# Altium schematic sheet Sheet1.SchDoc
size A3
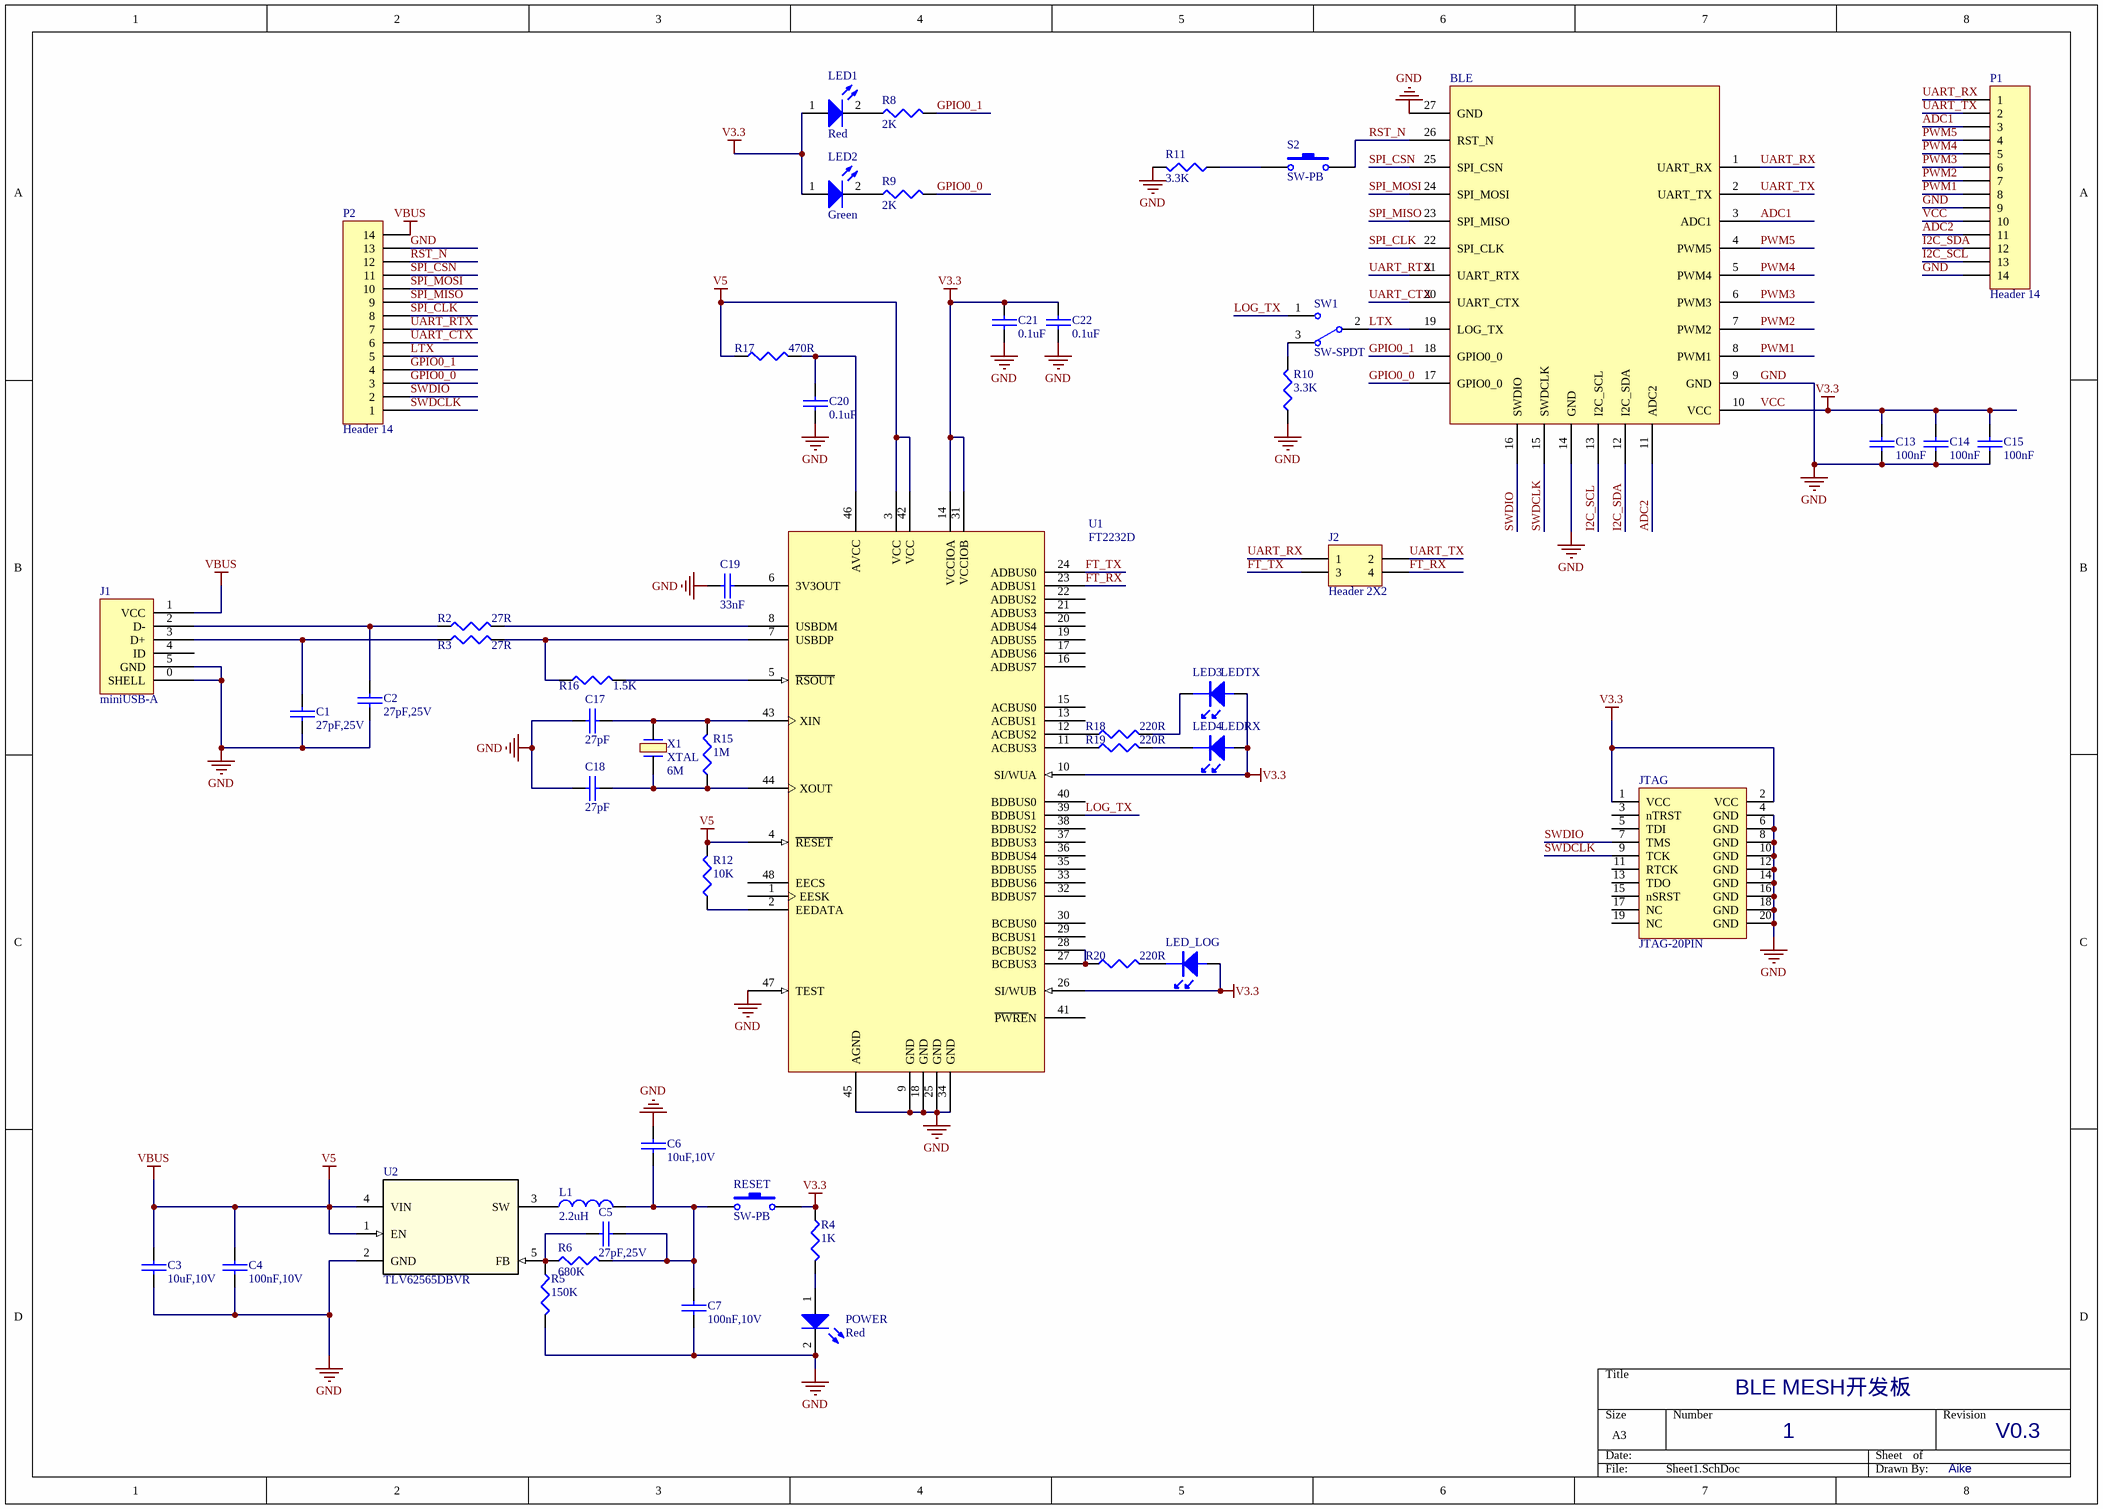
[diagram p0: Sheet1.SchDoc]

## Parts
BLE  BLE  [BLE]  (value not drawn)
C1  27pF,25V  [0603P]
C2  27pF,25V  [0603P]
C3  10uF,10V  [0603P]
C4  100nF,10V  [0603P]
C5  27pF,25V  [0603P]
C6  10uF,10V  [0603P]
C7  100nF,10V  [0603P]
C13  100nF  [0603P]
C14  100nF  [0603P]
C15  100nF  [0603P]
C17  27pF  [0603P]
C18  27pF  [0603P]
C19  33nF  [0603P]
C20  0.1uF  [0603P]
C21  0.1uF  [0603P]
C22  0.1uF  [0603P]
J1  miniUSB-A  [USB-min]
J2  Header 2X2  [HDR2X2]
JTAG  JTAG-20PIN  [IDC20_JTAG]
L1  2.2uH  [Inductor]
LED1  Red  [D0603]
LED2  Green  [D0603]
LED3  LEDTX  [LED_0603]
LED4  LEDRX  [LED_0603]
LED_LOG  LEDLOG  [LED_0603]  (value not drawn)
P1  Header 14  [HDR1X14]
P2  Header 14  [HDR1X14]
POWER  Red  [D0603]
R2  27R  [0603P]
R3  27R  [0603P]
R4  1K  [0603P]
R5  150K  [0603P]
R6  680K  [0603P]
R8  2K  [0603P]
R9  2K  [0603P]
R10  3.3K  [0603P]
R11  3.3K  [0603P]
R12  10K  [0603P]
R15  1M  [0603P]
R16  1.5K  [0603P]
R17  470R  [0603P]
R18  220R  [0603P]
R19  220R  [0603P]
R20  220R  [0603P]
RESET  SW-PB  [buttom_sp]
S2  SW-PB  [buttom_sp]
SW1  SW-SPDT  [SIP3]
U1  FT2232D  [TQFN48]
U2  TLV62565DBVR  [DBV0005A]
X1  XTAL  [XTAL]

## Nets
GND: BLE.9(GND) BLE.14(GND) BLE.27(GND) C1.1 C2.1 C3.2 C4.2 C6.1 C7.2 C13.2 C14.2 C15.2 C17.2 C18.2 C19.2 C20.1 C21.1 C22.1 J1.0(SHELL) J1.5(GND) JTAG.4(GND) JTAG.6(GND) JTAG.8(GND) JTAG.10(GND) JTAG.12(GND) JTAG.14(GND) JTAG.16(GND) JTAG.18(GND) JTAG.20(GND) P1.9 P1.14 P2.13 POWER.2(K) R5.2 R10.1 R11.2 U1.9(GND) U1.18(GND) U1.25(GND) U1.34(GND) U1.45(AGND) U1.47(TEST) U2.2(GND)
V5: C3.1 C4.1 J1.1(VCC) P2.14 R12.2 R17.1 U1.3(VCC) U1.4(~{RESET}) U1.42(VCC) U2.1(EN) U2.4(VIN)  [also labelled VBUS]
VCC: BLE.10(VCC) C13.1 C14.1 C15.1 C21.2 C22.2 JTAG.1(VCC) JTAG.2(VCC) LED1.1(A) LED2.1(A) LED3.1 LED4.1 LED_LOG.1 P1.10 R4.1 RESET.2 U1.10(SI/WUA) U1.14(VCCIOA) U1.26(SI/WUB) U1.31(VCCIOB)  [also labelled V3.3]
ADC1: BLE.3(ADC1) P1.3
ADC2: BLE.11(ADC2) P1.11
FT_RX: J2.4 U1.23(ADBUS1)
FT_TX: J2.3 U1.24(ADBUS0)
GPIO0_0: BLE.17(GPIO0_0) P2.3 R9.2
GPIO0_1: BLE.18(GPIO0_0) P2.4 R8.2
I2C_SCL: BLE.13(I2C_SCL) P1.13
I2C_SDA: BLE.12(I2C_SDA) P1.12
LOG_TX: SW1.1 U1.39(BDBUS1)
LTX: BLE.19(LOG_TX) P2.5 SW1.2
PWM1: BLE.8(PWM1) P1.8
PWM2: BLE.7(PWM2) P1.7
PWM3: BLE.6(PWM3) P1.6
PWM4: BLE.5(PWM4) P1.5
PWM5: BLE.4(PWM5) P1.4
RST_N: BLE.26(RST_N) P2.12 S2.2
SPI_CLK: BLE.22(SPI_CLK) P2.8
SPI_CSN: BLE.25(SPI_CSN) P2.11
SPI_MISO: BLE.23(SPI_MISO) P2.9
SPI_MOSI: BLE.24(SPI_MOSI) P2.10
SWDCLK: BLE.15(SWDCLK) JTAG.9(TCK) P2.1
SWDIO: BLE.16(SWDIO) JTAG.7(TMS) P2.2
UART_CTX: BLE.20(UART_CTX) P2.6
UART_RTX: BLE.21(UART_RTX) P2.7
UART_RX: BLE.1(UART_RX) J2.1 P1.1
UART_TX: BLE.2(UART_TX) J2.2 P1.2
NetC1_2: C1.2 J1.3(D+) R3.1
NetC2_2: C2.2 J1.2(D-) R2.1
NetC5_1: C5.1 R5.1 R6.1 U2.5(FB)
NetC5_2: C5.2 C6.2 C7.1 L1.2 R6.2 RESET.1
NetC17_1: C17.1 R15.2 U1.43(XIN) X1.2
NetC18_1: C18.1 R15.1 U1.44(XOUT) X1.1
NetC19_1: C19.1 U1.6(3V3OUT)
NetC20_2: C20.2 R17.2 U1.46(AVCC)
NetL1_1: L1.1 U2.3(SW)
NetLED1_2: LED1.2(K) R8.1
NetLED2_2: LED2.2(K) R9.1
NetLED3_2: LED3.2 R18.2
NetLED4_2: LED4.2 R19.2
NetLED_LOG_2: LED_LOG.2 R20.2
NetPOWER_1: POWER.1(A) R4.2
NetR2_2: R2.2 U1.8(USBDM)
NetR3_2: R3.2 R16.1 U1.7(USBDP)
NetR10_2: R10.2 SW1.3
NetR11_1: R11.1 S2.1
NetR12_1: R12.1 U1.2(EEDATA)
NetR16_2: R16.2 U1.5(~{RSOUT})
NetR18_1: R18.1 U1.12(ACBUS2)
NetR19_1: R19.1 U1.11(ACBUS3)
NetR20_1: R20.1 U1.27(BCBUS3) U1.28(BCBUS2)

Not connected (* = marked no-connect by the designer): J1 4(ID); JTAG 3(nTRST) 5(TDI) 11(RTCK) 13(TDO) 15(nSRST) 17(NC) 19(NC); U1 1(EESK) 13(ACBUS1) 15(ACBUS0) 16(ADBUS7) 17(ADBUS6) 19(ADBUS5) 20(ADBUS4) 21(ADBUS3) 22(ADBUS2) 29(BCBUS1) 30(BCBUS0) 32(BDBUS7) 33(BDBUS6) 35(BDBUS5) 36(BDBUS4) 37(BDBUS3) 38(BDBUS2) 40(BDBUS0) 41(~{PWRE}N) 48(EECS)

## Notes on the sheet
- BLE MESH开发板
- 1
- V0.3
- Aike
- (in symbol XTAL) 6M

## Library data of the parts
C1-C7 C13-C15 C17-C22 = CAP: Capacitor
J1 = miniUSB-A: miniUSB-A  interface
J2 = Header 2X2: Header, 2-Pin, Dual row; LatestRevisionDate: 17-Jul-2002; LatestRevisionNote: Re-released for DXP Platform.; Publisher: Altium Limited
JTAG = ARM_JTAG: ARM_JTAG-20PIN
L1 = Inductor: Value: 100uH; Published: 8-Jun-2000; Revision: July-2002: Re-released for DXP Platform.; Publisher: Altium Limited
LED1 LED2 POWER = LED2: Typical RED, GREEN, YELLOW, AMBER GaAs LED; Published: 8-Jun-2000; Revision: July-2002: Re-released for DXP Platform.; Publisher: Altium Limited
LED3 LED4 LED_LOG = LED: Part Field 1: 0; Part Field 10: 1u; Part Field 2: 0; Part Field 3: 0; Part Field 4: 0; Part Field 5: 1; Part Field 6: 0; Part Field 7: 1n; Part Field 8: 1n; Part Field 9: 500n
P1 P2 = Header 14: Header, 14-Pin; LatestRevisionDate: 17-Jul-2002; LatestRevisionNote: Re-released for DXP Platform.; Publisher: Altium Limited
R2-R6 R8-R12 R15-R20 = R: Right: 20; Bottom: 30
RESET S2 = SW-PB: Switch; Published: 24-Mar-1999; LatestRevisionDate: 17-Jul-2002; LatestRevisionNote: Re-released for DXP Platform.; PackageReference: SPST-2; Publisher: Altium Limited; PackageDescription: Switch; 2 Leads
SW1 = SW-SPDT: SPDT Subminiature Toggle Switch, Right Angle Mounting, Vertical Actuation; Revision 1: Jul-2002: Re-released for DXP Platform.; Revision 2: 17-Dec-2003: Schematic revised, PCB Footprint replaced.; Published: 24-Mar-1999; Datasheet: Latest Revision: 05-Dec-2000; Publisher: Altium Limited
U1 = FD2232D
U2 = TLV62565DBVR: Imported; Alternate_Manufacturer: None; Manufacturer: Texas Instruments; CurrentTime: Not shown in title block; DocumentNumber: 1; SymbolCreator: a0411947; CompType: IC; U/M: EA; Designator: U?; PIN_COUNT: 5; CurrentDate: Not shown in title block; Time: Not shown in title block; Date: Not shown in title block; DocumentFullPathAndName: Not shown in title block; DocumentName: Not shown in title block; ModifiedDate: Not shown in title block; ApprovedBy: Not shown in title block; CheckedBy: Not shown in title block; Author: Not shown in title block; CompanyName: Not shown in title block; Engineer: Not shown in title block; Organization: Not shown in title block; Address1: Not shown in title block; Address2: Not shown in title block; Address3: Not shown in title block; Address4: Not shown in title block; Revision: Use project parameter SCH_Rev; SheetNumber: 1; SheetTotal: 1; ImagePath: Not shown in title block; Rule: *; ProjectName: *; SymbolVersion: 2014-02-06; PartNumber: TLV62565DBV; PackageReference: DBV0005A; MountType: SMT; ComponentLink1Description: Datasheet Link; ComponentLink1URL: http://www.ti.com/lit/ds/symlink/tlv62565.pdf; RoHS: Y; Publisher: Texas Instruments; LatestRevisionDate: 2014-02-20; Value: Value; Type: Type; RefDes: Refdes